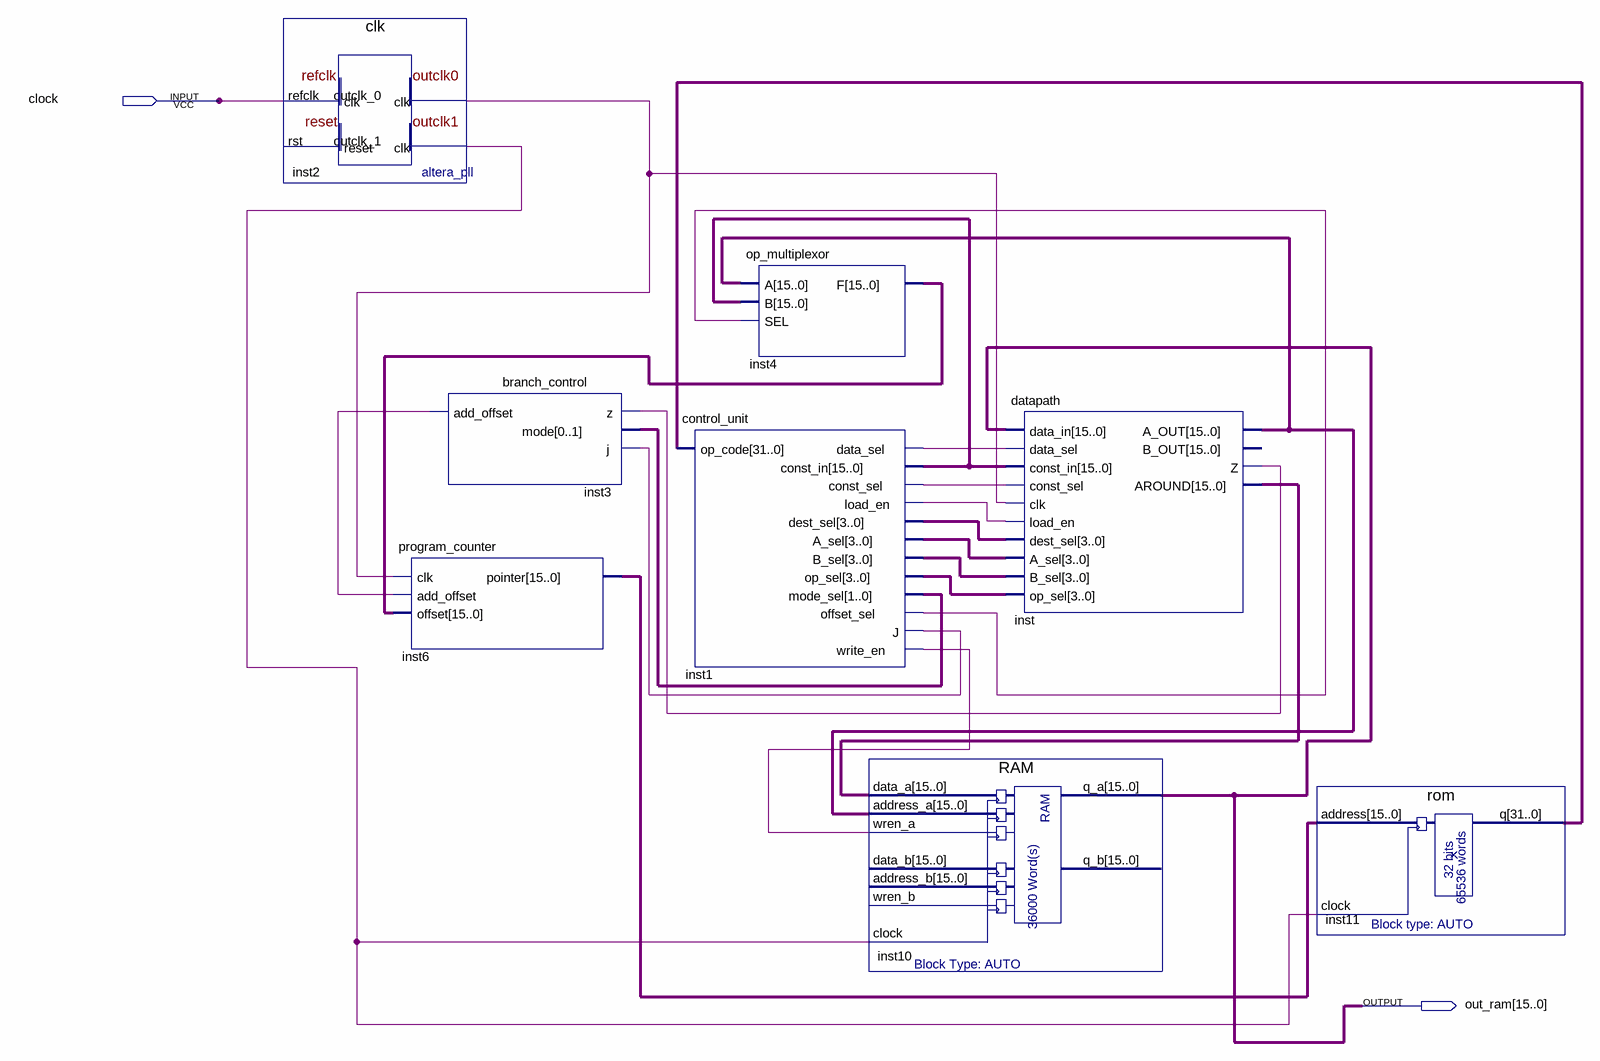
[diagram p0: schematic sheet]
// Quartus schematic Main_Circuit.bdf as structural Verilog: 8 symbols, 2 pins
module Main_Circuit (
  input  clock,
  output [15:0] out_ram
);

  wire inst1_const_sel, inst1_data_sel, inst1_j, inst1_load_en, inst1_offset_sel, inst1_write_en,
       inst2_outclk_0, inst2_outclk_1, inst3_add_offset, inst_z;
  wire [1:0] inst1_mode_sel;
  wire [3:0] inst1_a_sel, inst1_b_sel, inst1_dest_sel, inst1_op_sel;
  wire [15:0] inst1_const_in, inst4_f, inst6_pointer, inst_a_out, inst_around;
  wire [31:0] inst11_q;

  clk inst2 (.refclk(clock), .outclk_0(inst2_outclk_0), .outclk_1(inst2_outclk_1));  // open: rst
  program_counter inst6 (
    .clk(inst2_outclk_0), .add_offset(inst3_add_offset), .offset(inst4_f), .pointer(inst6_pointer));
  branch_control inst3 (.z(inst_z), .mode(inst1_mode_sel), .j(inst1_j), .add_offset(inst3_add_offset));
  control_unit inst1 (
    .op_code(inst11_q), .data_sel(inst1_data_sel), .const_in(inst1_const_in), .const_sel(inst1_const_sel),
    .load_en(inst1_load_en), .dest_sel(inst1_dest_sel), .A_sel(inst1_a_sel), .B_sel(inst1_b_sel),
    .op_sel(inst1_op_sel), .mode_sel(inst1_mode_sel), .offset_sel(inst1_offset_sel), .J(inst1_j),
    .write_en(inst1_write_en));
  op_multiplexor inst4 (.A(inst_a_out), .B(inst1_const_in), .SEL(inst1_offset_sel), .F(inst4_f));
  RAM inst10 (
    .data_a(inst_around), .address_a(inst_a_out), .wren_a(inst1_write_en), .clock(inst2_outclk_1),
    .q_a(out_ram));  // open: data_b, address_b, wren_b, q_b
  datapath inst (
    .data_in(out_ram), .data_sel(inst1_data_sel), .const_in(inst1_const_in), .const_sel(inst1_const_sel),
    .clk(inst2_outclk_0), .load_en(inst1_load_en), .dest_sel(inst1_dest_sel), .A_sel(inst1_a_sel),
    .B_sel(inst1_b_sel), .op_sel(inst1_op_sel), .A_OUT(inst_a_out), .Z(inst_z), .AROUND(inst_around));  // open: B_OUT
  rom inst11 (.address(inst6_pointer), .clock(inst2_outclk_1), .q(inst11_q));
endmodule
